# EAGLE design power_board (EAGLE 7.6.0)
DRAWING_NAME: Xiaochuan Chen; DRAWING_TITLE: ARVP Power Board; REVISION: 3.0
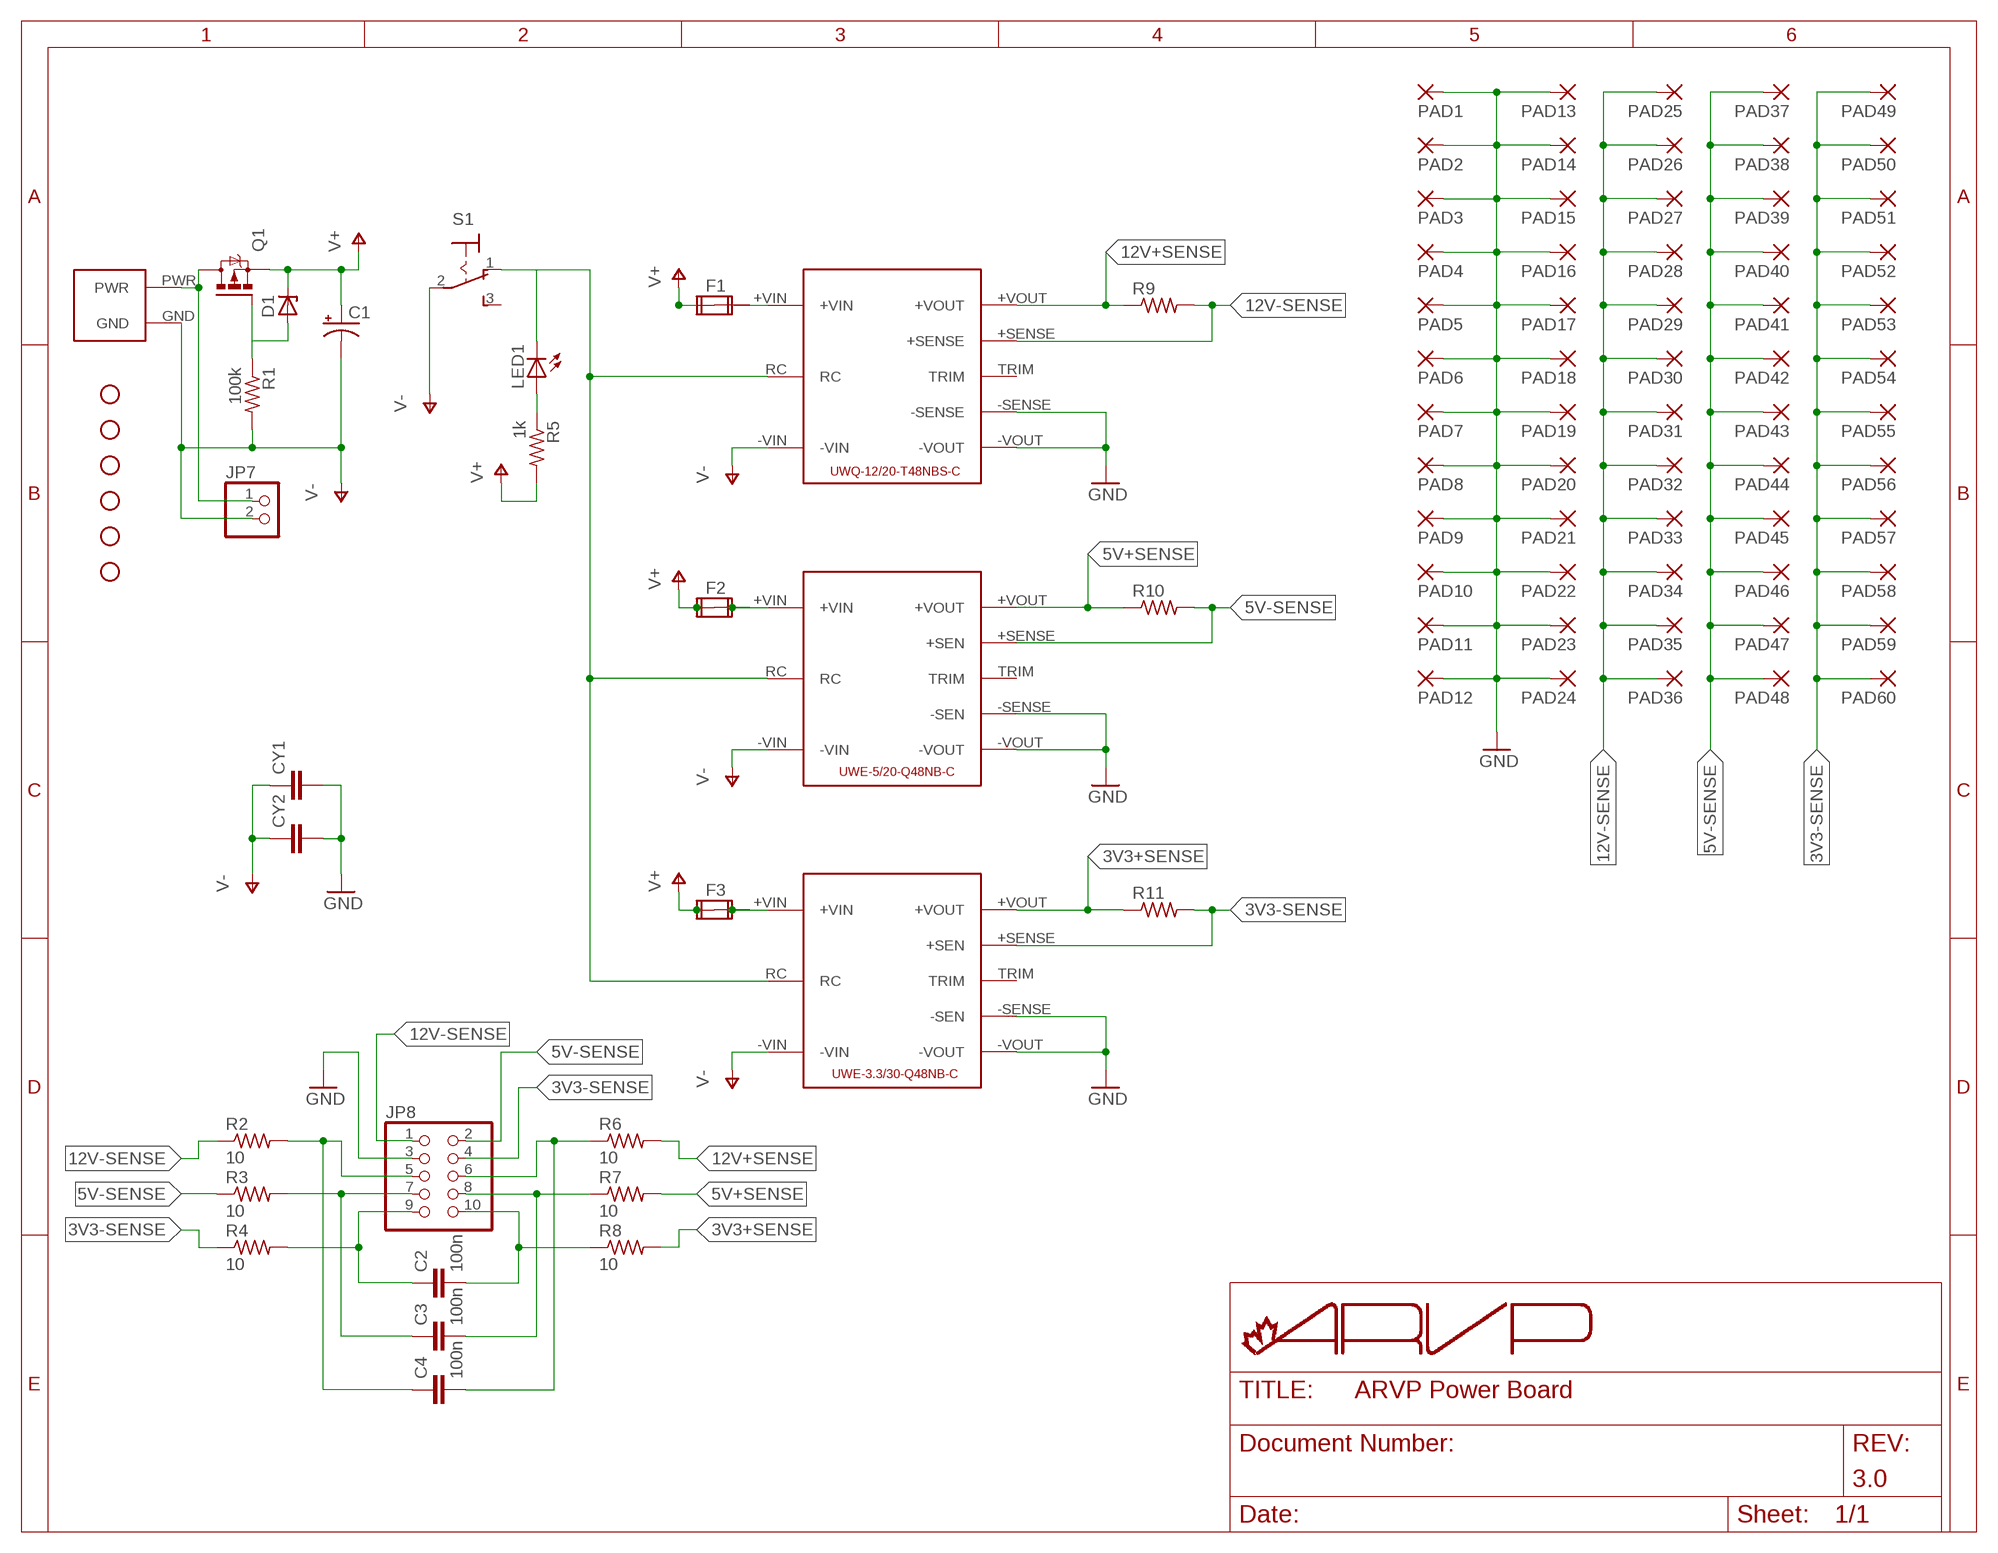
[diagram p0: schematic, sheet 1]

## Parts
C1  CPOL-USE5-10.5  [E5-10,5]
C2  100n  C-EU025-024X044  [C025-024X044]
C3  100n  C-EU025-024X044  [C025-024X044]
C4  100n  C-EU025-024X044  [C025-024X044]
CY1  CYYC7B5  [YC7B5]
CY2  CYYC7B5  [YC7B5]
D1  ZENER-DIODEDO35Z10  [DO35Z10]
F1  FUSE2P  [FUSE1]
F2  FUSE2P  [FUSE1]
F3  FUSE2P  [FUSE1]
JP1  STAND-OFF  [STAND-OFF]
JP2  STAND-OFF  [STAND-OFF]
JP3  STAND-OFF  [STAND-OFF]
JP4  STAND-OFF  [STAND-OFF]
JP5  STAND-OFF  [STAND-OFF]
JP6  STAND-OFF  [STAND-OFF]
JP7  PINHD-1X2  [1X02]
JP8  PINHD-2X5  [2X05]
LED1  LED3MM  [LED3MM]
P$1  AND_PWR  [AND_PWR]
PAD1  2,15/1,0  [2,15/1,0]
PAD2  2,15/1,0  [2,15/1,0]
PAD3  2,15/1,0  [2,15/1,0]
PAD4  2,15/1,0  [2,15/1,0]
PAD5  2,15/1,0  [2,15/1,0]
PAD6  2,15/1,0  [2,15/1,0]
PAD7  2,15/1,0  [2,15/1,0]
PAD8  2,15/1,0  [2,15/1,0]
PAD9  2,15/1,0  [2,15/1,0]
PAD10  2,15/1,0  [2,15/1,0]
PAD11  2,15/1,0  [2,15/1,0]
PAD12  2,15/1,0  [2,15/1,0]
PAD13  2,15/1,0  [2,15/1,0]
PAD14  2,15/1,0  [2,15/1,0]
PAD15  2,15/1,0  [2,15/1,0]
PAD16  2,15/1,0  [2,15/1,0]
PAD17  2,15/1,0  [2,15/1,0]
PAD18  2,15/1,0  [2,15/1,0]
PAD19  2,15/1,0  [2,15/1,0]
PAD20  2,15/1,0  [2,15/1,0]
PAD21  2,15/1,0  [2,15/1,0]
PAD22  2,15/1,0  [2,15/1,0]
PAD23  2,15/1,0  [2,15/1,0]
PAD24  2,15/1,0  [2,15/1,0]
PAD25  2,15/1,0  [2,15/1,0]
PAD26  2,15/1,0  [2,15/1,0]
PAD27  2,15/1,0  [2,15/1,0]
PAD28  2,15/1,0  [2,15/1,0]
PAD29  2,15/1,0  [2,15/1,0]
PAD30  2,15/1,0  [2,15/1,0]
PAD31  2,15/1,0  [2,15/1,0]
PAD32  2,15/1,0  [2,15/1,0]
PAD33  2,15/1,0  [2,15/1,0]
PAD34  2,15/1,0  [2,15/1,0]
PAD35  2,15/1,0  [2,15/1,0]
PAD36  2,15/1,0  [2,15/1,0]
PAD37  2,15/1,0  [2,15/1,0]
PAD38  2,15/1,0  [2,15/1,0]
PAD39  2,15/1,0  [2,15/1,0]
PAD40  2,15/1,0  [2,15/1,0]
PAD41  2,15/1,0  [2,15/1,0]
PAD42  2,15/1,0  [2,15/1,0]
PAD43  2,15/1,0  [2,15/1,0]
PAD44  2,15/1,0  [2,15/1,0]
PAD45  2,15/1,0  [2,15/1,0]
PAD46  2,15/1,0  [2,15/1,0]
PAD47  2,15/1,0  [2,15/1,0]
PAD48  2,15/1,0  [2,15/1,0]
PAD49  2,15/1,0  [2,15/1,0]
PAD50  2,15/1,0  [2,15/1,0]
PAD51  2,15/1,0  [2,15/1,0]
PAD52  2,15/1,0  [2,15/1,0]
PAD53  2,15/1,0  [2,15/1,0]
PAD54  2,15/1,0  [2,15/1,0]
PAD55  2,15/1,0  [2,15/1,0]
PAD56  2,15/1,0  [2,15/1,0]
PAD57  2,15/1,0  [2,15/1,0]
PAD58  2,15/1,0  [2,15/1,0]
PAD59  2,15/1,0  [2,15/1,0]
PAD60  2,15/1,0  [2,15/1,0]
Q1  IPP80P03P4L04AKSA1  [TO220BV]
R1  100k  R-US_0204/7  [0204/7]
R2  10  R-US_0204/5  [0204/5]
R3  10  R-US_0204/5  [0204/5]
R4  10  R-US_0204/5  [0204/5]
R5  1k  R-US_0204/7  [0204/7]
R6  10  R-US_0204/5  [0204/5]
R7  10  R-US_0204/5  [0204/5]
R8  10  R-US_0204/5  [0204/5]
R9  R-US_0617/22  [0617/22]
R10  R-US_0617/22  [0617/22]
R11  R-US_0617/22  [0617/22]
S1  M9040P  [M9040P]
U1  UWQ-12/20-T48NBS-C  [UWQ-12/20-T48]
U2  UWE-5/20-Q48NB-C  [UWE-100-120W]
U3  UWE-3.3/30-Q48NB-C  [UWE-100-120W]

## Nets
3V3+SENSE: R8.2 R11.1 U3.+VOUT
3V3-SENSE: JP8.4 PAD49.1(P) PAD50.1(P) PAD51.1(P) PAD52.1(P) PAD53.1(P) PAD54.1(P) PAD55.1(P) PAD56.1(P) PAD57.1(P) PAD58.1(P) PAD59.1(P) PAD60.1(P) R4.1 R11.2 U3.+SENSE(+SEN)
5V+SENSE: R7.2 R10.1 U2.+VOUT
5V-SENSE: JP8.2 PAD37.1(P) PAD38.1(P) PAD39.1(P) PAD40.1(P) PAD41.1(P) PAD42.1(P) PAD43.1(P) PAD44.1(P) PAD45.1(P) PAD46.1(P) PAD47.1(P) PAD48.1(P) R3.1 R10.2 U2.+SENSE(+SEN)
12V+SENSE: R6.2 R9.1 U1.+VOUT
12V-SENSE: JP8.1 PAD25.1(P) PAD26.1(P) PAD27.1(P) PAD28.1(P) PAD29.1(P) PAD30.1(P) PAD31.1(P) PAD32.1(P) PAD33.1(P) PAD34.1(P) PAD35.1(P) PAD36.1(P) R2.1 R9.2 U1.+SENSE
GND: CY1.2 CY2.2 JP8.3 PAD1.1(P) PAD2.1(P) PAD3.1(P) PAD4.1(P) PAD5.1(P) PAD6.1(P) PAD7.1(P) PAD8.1(P) PAD9.1(P) PAD10.1(P) PAD11.1(P) PAD12.1(P) PAD13.1(P) PAD14.1(P) PAD15.1(P) PAD16.1(P) PAD17.1(P) PAD18.1(P) PAD19.1(P) PAD20.1(P) PAD21.1(P) PAD22.1(P) PAD23.1(P) PAD24.1(P) U1.-SENSE U1.-VOUT U2.-SENSE(-SEN) U2.-VOUT U3.-SENSE(-SEN) U3.-VOUT
J3: C4.1 JP8.5 R2.2
J4: C4.2 JP8.6 R6.1
J5: C3.1 JP8.7 R3.2
J6: C3.2 JP8.8 R7.1
J7: C2.1 JP8.9 R4.2
J8: C2.2 JP8.10 R8.1
N$1: LED1.A R5.1
N$4: D1.A Q1.G R1.1
N$5: F1.2A F1.2B U1.+VIN
N$6: F2.2A F2.2B U2.+VIN
N$7: F3.2A F3.2B U3.+VIN
ON/OFF: LED1.K(C) S1.1(O) U1.RC U2.RC U3.RC
V+: C1.+ D1.C F1.1A F1.1B F2.1A F2.1B F3.1A F3.1B Q1.S R5.2
V-: C1.- CY1.1 CY2.1 JP7.2 P$1.GND R1.2 S1.2(P) U1.-VIN U2.-VIN U3.-VIN
VBAT+: JP7.1 P$1.PWR Q1.D
Unconnected: S1.3(S) U1.TRIM U2.TRIM U3.TRIM

## Library data of the parts
C1 = rcl:CPOL-US: POLARIZED CAPACITOR, American symbol
C2-C4 = rcl:C-EU: CAPACITOR, European symbol
CY1 CY2 = rcl:CY: Y CAPACITOR for power line
D1 = diode:ZENER-DIODE: Z-Diode
F1-F3 = special:FUSE2P: FUSE 5 x 20 mm
JP1-JP6 = SparkFun:STAND-OFF: Stand Off This is the mechanical footprint for a #4 phillips button head screw. Use the keepout ring to avoid running the screw head into surrounding components. SKU : PRT-00447
JP7 = pinhead:PINHD-1X2: PIN HEADER
JP8 = pinhead:PINHD-2X5: PIN HEADER
LED1 = led:LED: LED OSRAM: - CHIPLED LG R971, LG N971, LY N971, LG Q971, LY Q971, LO R971, LY R971 LH N974, LH R974 LS Q976, LO Q976, LY Q976 LO Q996 - Hyper CHIPLED LW Q18S LB Q993, LB Q99A, LB R99A - SideLED LS A670, LO A670, LY A670, LG A670, LP A670 LB A673, LV A673, LT A673, LW A673 LH A674 LY A675 LS A676, LA A676, LO A676, LY A676, LW A676 LS A679, LY A679, LG A679 - Hyper Micro SIDELED® LS Y876, LA Y876, LO Y876, LY Y876 LT Y87S - SmartLED LW L88C, LW L88S LB L89C, LB L89S, LG L890 LS L89K, LO L89K, LY L89K LS L896, LA L896, LO L896, LY L896 - TOPLED LS T670, LO T670, LY T670, LG T670, LP T670 LSG T670, LSP T670, LSY T670, LOP T670, LYG T670 LG T671, LOG T671, LSG T671 LB T673, LV T673, LT T673, LW T673 LH T674 LS T676, LA T676, LO T676, LY T676, LB T676, LH T676, LSB T676, LW T676 LB T67C, LV T67C, LT T67C, LS T67K, LO T67K, LY T67K, LW E67C LS E67B, LA E67B, LO E67B, LY E67B, LB E67C, LV E67C, LT E67C LW T67C LS T679, LY T679, LG T679 LS T770, LO T770, LY T770, LG T770, LP T770 LB T773, LV T773, LT T773, LW T773 LH T774 LS E675, LA E675, LY E675, LS T675 LS T776, LA T776, LO T776, LY T776, LB T776 LHGB T686 LT T68C, LB T68C - Hyper Mini TOPLED® LB M676 - Mini TOPLED Santana® LG M470 LS M47K, LO M47K, LY M47K Source: http://www.osram.convergy.de LUXEON: - LUMILED® LXK2-PW12-R00, LXK2-PW12-S00, LXK2-PW14-U00, LXK2-PW14-V00 LXK2-PM12-R00, LXK2-PM12-S00, LXK2-PM14-U00 LXK2-PE12-Q00, LXK2-PE12-R00, LXK2-PE12-S00, LXK2-PE14-T00, LXK2-PE14-U00 LXK2-PB12-K00, LXK2-PB12-L00, LXK2-PB12-M00, LXK2-PB14-N00, LXK2-PB14-P00, LXK2-PB14-Q00 LXK2-PR12-L00, LXK2-PR12-M00, LXK2-PR14-Q00, LXK2-PR14-R00 LXK2-PD12-Q00, LXK2-PD12-R00, LXK2-PD12-S00 LXK2-PH12-R00, LXK2-PH12-S00 LXK2-PL12-P00, LXK2-PL12-Q00, LXK2-PL12-R00 Source: www.luxeon.com KINGBRIGHT: KA-3528ASYC Source: www.kingbright.com
P$1 = ARVP:AND_PWR
PAD1-PAD60 = wirepad:2,15/1,0: THROUGH-HOLE PAD
Q1 = transistor-power:IPP80P03P4L04AKSA1: P-CHANNEL MOS-FET SYMBOL
R1 R5 = resistor:R-US_: RESISTOR, American symbol
R2-R4 R6-R11 = rcl:R-US_: RESISTOR, American symbol
S1 = switch:M9040P: TOGGLE SWITCH Marquardt
U1 = New Power Board Library:UWQ-12/20-T48NBS-C
U2 = New Power Board Library:UWE-5/20-Q48NB-C
U3 = New Power Board Library:UWE-3.3/30-Q48NB-C

## Net classes
0 default: clearance 0.205 mm

## Board
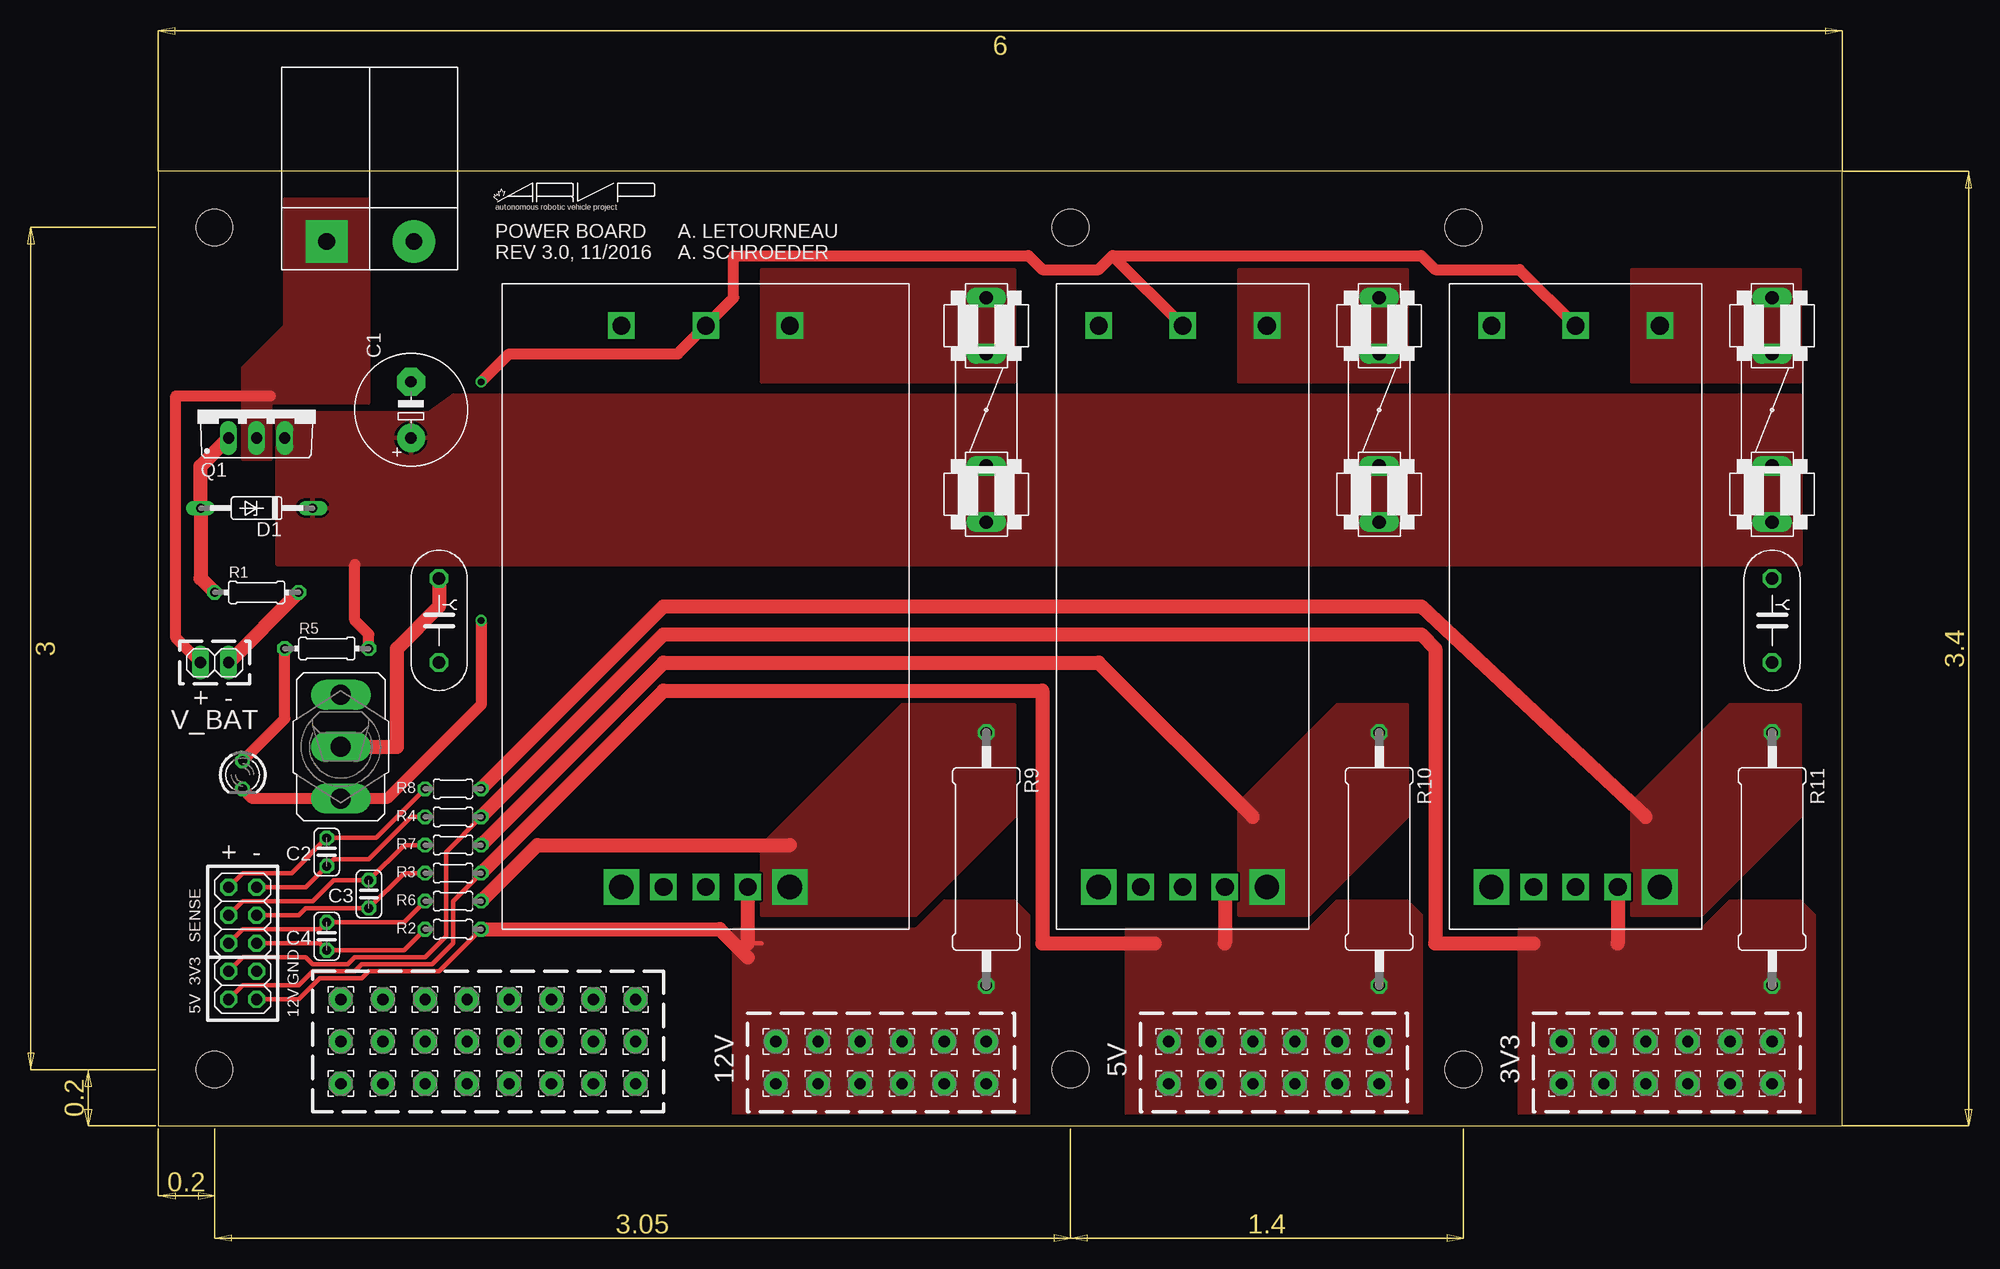
[diagram p1: board, top side]
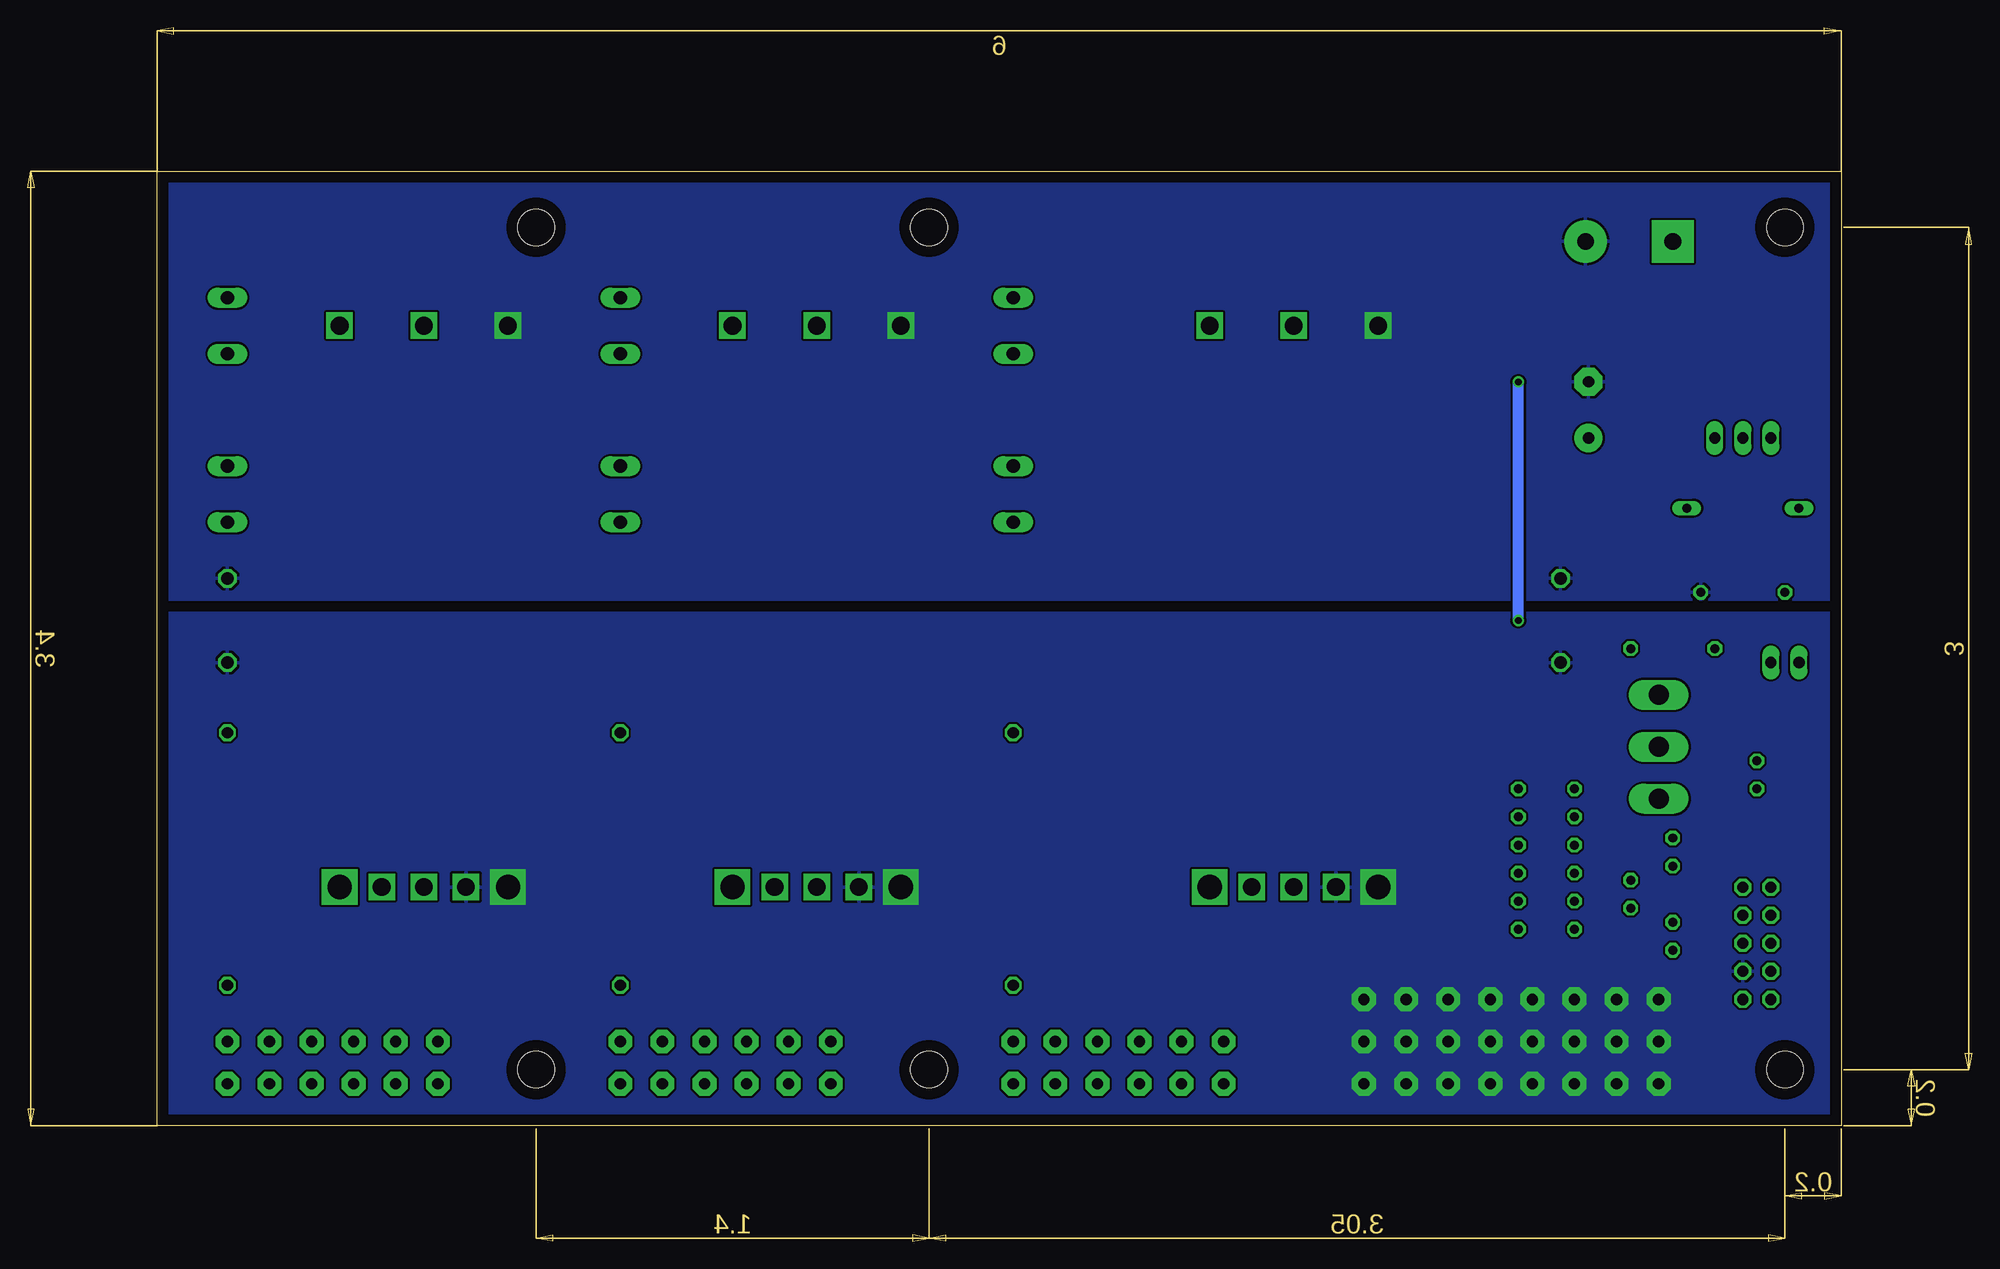
[diagram p2: board, bottom side, seen from below]

Size 152.4 x 86.36 mm. Coordinates in mm from the lower left corner, seen from the top.
Outline: 0,0 152.4,0 152.4,86.36 0,86.36 0,0
Copper layers (1*16): Top 0.035mm / dielectric 1.5mm / Bottom 0.035mm
Design rules "Power_Board": minimum track width 20mil, minimum drill 24mil, track to track 0.205mm, track to pad 12mil, pad to pad 0.205mm, via to via 0.205mm, smd to smd 8mil, copper to edge 40mil, drill to drill 8mil, minimum pad ring 10mil, minimum via ring 8mil, stop-mask expansion 4mil, vias tented up to drill 0mil, thermal gap 10mil

### Footprints (pad centres in the part's own frame; a part is rotated, then mirrored left to right if it is on the bottom)
E5-10,5 = drill 1.016 pad 2.54: + -2.54,0 | drill 1.016 pad 2.54 octagon: - 2.54,0
C025-024X044 = drill 0.813 octagon: 1 -1.27,0; 2 1.27,0
YC7B5 = drill 1.118 octagon: 1 -3.81,0; 2 3.81,0
DO35Z10 = drill 0.813 long: A 5.08,0; C -5.08,0
FUSE1 = drill 1.194 long: 1A -10.16,0; 1B -5.08,0; 2A 10.16,0; 2B 5.08,0
STAND-OFF = hole 3.302: 0,0
1X02 = drill 1.016 long: 1 -1.27,0; 2 1.27,0
2X05 = drill 1.016 octagon: 1 -5.08,-1.27; 2 -5.08,1.27; 3 -2.54,-1.27; 4 -2.54,1.27; 5 0,-1.27; 6 0,1.27; 7 2.54,-1.27; 8 2.54,1.27; 9 5.08,-1.27; 10 5.08,1.27
LED3MM = drill 0.813 octagon: A -1.27,0; K 1.27,0
AND_PWR = drill 1.524 pad 3.81: GND 0,-7.886 | drill 1.524 pad 3.81 square: PWR 0,0
2,15/1,0 = drill 1.016 pad 2.159 octagon: 1 0,0
TO220BV = drill 1.016 long: D 0,-2.54; G -2.54,-2.54; S 2.54,-2.54
0204/7 = drill 0.813 octagon: 1 -3.81,0; 2 3.81,0
0204/5 = drill 0.813 octagon: 1 -2.54,0; 2 2.54,0
0617/22 = drill 1.016 octagon: 1 -11.43,0; 2 11.43,0
M9040P = drill 1.803 long: 1 0,4.699; 2 0,0; 3 0,-4.699
UWQ-12/20-T48 = drill 1.6 square: +SENSE 25.4,3.81; +VIN -25.4,7.62; -SENSE 25.4,-3.81; -VIN -25.4,-7.62; RC -25.4,0; TRIM 25.4,0 | drill 2.2 square: +VOUT 25.4,7.62; -VOUT 25.4,-7.62
UWE-100-120W = drill 1.6 square: +SENSE 25.4,3.81; +VIN -25.4,7.62; -SENSE 25.4,-3.81; -VIN -25.4,-7.62; RC -25.4,0; TRIM 25.4,0 | drill 2.2 square: +VOUT 25.4,7.62; -VOUT 25.4,-7.62

### Placement (x,y rotation side)
C1  22.86,64.77 90 top
C2  15.24,24.77 90 top
C3  19.05,20.95 90 top
C4  15.24,17.14 90 top
CY1  25.4,45.72 270 top
CY2  146.05,45.72 270 top
D1  8.89,55.88 180 top
F1  74.93,64.77 90 top
F2  110.49,64.77 90 top
F3  146.05,64.77 90 top
JP1  82.55,5.08 0 top
JP2  118.11,5.08 0 top
JP3  118.11,81.28 0 top
JP4  5.08,5.08 0 top
JP5  5.08,81.28 0 top
JP6  82.55,81.28 0 top
JP7  5.08,41.91 0 top
JP8  7.62,16.51 90 top
LED1  7.62,31.75 270 top
P$1  15.24,80.01 90 top
PAD1  43.18,11.43 0 top
PAD2  39.37,11.43 0 top
PAD3  35.56,11.43 0 top
PAD4  31.75,11.43 0 top
PAD5  27.94,11.43 0 top
PAD6  24.13,11.43 0 top
PAD7  20.32,11.43 0 top
PAD8  16.51,11.43 0 top
PAD9  16.51,7.62 0 top
PAD10  20.32,7.62 0 top
PAD11  24.13,7.62 0 top
PAD12  27.94,7.62 0 top
PAD13  31.75,7.62 0 top
PAD14  35.56,7.62 0 top
PAD15  39.37,7.62 0 top
PAD16  43.18,7.62 0 top
PAD17  43.18,3.81 0 top
PAD18  39.37,3.81 0 top
PAD19  35.56,3.81 0 top
PAD20  31.75,3.81 0 top
PAD21  27.94,3.81 0 top
PAD22  24.13,3.81 0 top
PAD23  20.32,3.81 0 top
PAD24  16.51,3.81 0 top
PAD25  71.12,7.62 0 top
PAD26  67.31,7.62 0 top
PAD27  63.5,7.62 0 top
PAD28  59.69,7.62 0 top
PAD29  55.88,7.62 0 top
PAD30  74.93,3.81 0 top
PAD31  71.12,3.81 0 top
PAD32  67.31,3.81 0 top
PAD33  63.5,3.81 0 top
PAD34  59.69,3.81 0 top
PAD35  55.88,3.81 0 top
PAD36  74.93,7.62 0 top
PAD37  106.68,3.81 0 top
PAD38  102.87,3.81 0 top
PAD39  99.06,3.81 0 top
PAD40  95.25,3.81 0 top
PAD41  91.44,3.81 0 top
PAD42  110.49,7.62 0 top
PAD43  106.68,7.62 0 top
PAD44  102.87,7.62 0 top
PAD45  99.06,7.62 0 top
PAD46  95.25,7.62 0 top
PAD47  91.44,7.62 0 top
PAD48  110.49,3.81 0 top
PAD49  142.24,3.81 0 top
PAD50  138.43,3.81 0 top
PAD51  134.62,3.81 0 top
PAD52  130.81,3.81 0 top
PAD53  127,3.81 0 top
PAD54  146.05,3.81 0 top
PAD55  146.05,7.62 0 top
PAD56  142.24,7.62 0 top
PAD57  138.43,7.62 0 top
PAD58  134.62,7.62 0 top
PAD59  130.81,7.62 0 top
PAD60  127,7.62 0 top
Q1  8.89,64.77 0 top
R1  8.89,48.26 0 top
R2  26.67,17.78 180 top
R3  26.67,22.86 180 top
R4  26.67,27.94 180 top
R5  15.24,43.18 0 top
R6  26.67,20.32 0 top
R7  26.67,25.4 0 top
R8  26.67,30.48 0 top
R9  74.93,24.13 270 top
R10  110.49,24.13 270 top
R11  146.05,24.13 270 top
S1  16.51,34.29 180 top
U1  49.53,46.99 270 top
U2  92.71,46.99 270 top
U3  128.27,46.99 270 top
U$1  [DINA5_L]  -30.48,-74.93 0 top  (outside the outline)
U$2  [DOCFIELD]  128.27,-71.12 0 top  (outside the outline)
U$3  [ARVP]  30.48,82.87 0 top

### Tracks (layer width: path | path; a pad name or v marks a point on that pad's centre or on a via)
3V3+SENSE
  Top 1.27: R8.2 45.72,46.99 114.3,46.99 134.62,27.94
  pour Top (no thermals): 148.59,38.1 142.24,38.1 133.35,29.21 133.35,19.05 139.7,19.05 148.59,27.94
3V3-SENSE
  Top 0.406: R4.1 26.04,24.77 26.04,17.14 24.13,15.24 17.78,15.24 17.14,14.61 13.97,14.61 13.34,15.24 7.62,15.24 JP8.4
  Top 1.27: U3.+SENSE 132.08,16.51 | R4.1 45.72,44.45 114.3,44.45 115.57,43.18 115.57,16.51 124.46,16.51
  pour Top (no thermals): 148.59,20.32 149.86,19.05 149.86,0 123.19,0 123.19,17.78 139.7,17.78 142.24,20.32
5V+SENSE
  Top 1.27: R7.2 45.72,41.91 85.09,41.91 99.06,27.94
  pour Top (no thermals): 97.79,19.05 97.79,29.21 106.68,38.1 113.03,38.1 113.03,27.94 104.14,19.05
5V-SENSE
  Top 0.406: R3.1 26.67,20.32 26.67,16.51 24.77,14.61 18.41,14.61 17.78,13.97 13.97,13.97 12.7,12.7 7.62,12.7 JP8.2
  Top 1.27: U2.+SENSE 96.52,16.51 | R3.1 45.72,39.37 80.01,39.37 80.01,16.51 90.17,16.51
  pour Top (no thermals): 113.03,20.32 106.68,20.32 104.14,17.78 87.63,17.78 87.63,0 114.3,0 114.3,19.05
12V+SENSE
  Top 1.27: R6.2 34.29,25.4 57.15,25.4
  pour Top (no thermals): 54.61,19.05 68.58,19.05 77.47,27.94 77.47,38.1 67.31,38.1 54.61,25.4
12V-SENSE
  Top 0.406: 53.34,16.51 54.61,16.51 | R2.1 25.4,13.97 19.05,13.97 18.41,13.34 14.61,13.34 12.7,11.43 JP8.1
  Top 1.27: U1.+SENSE 53.34,16.51 | R2.1 50.8,17.78 53.34,15.24
  pour Top (no thermals): 77.47,20.32 71.12,20.32 68.58,17.78 52.07,17.78 52.07,0 78.74,0 78.74,19.05
GND
  pour Bottom: 152.4,46.35 152.4,0 -1.27,0 -1.27,46.35
  pour Bottom (no thermals): 39.37,24.13 39.37,19.05 44.13,19.05 44.13,24.13
  pour Bottom (no thermals): 82.55,24.13 82.55,19.05 87.31,19.05 87.31,24.13
  pour Bottom (no thermals): 118.11,24.13 118.11,19.05 122.87,19.05 122.87,24.13
  pour Bottom (no thermals): 15.24,12.7 15.24,2.54 44.45,2.54 44.45,12.7
J3
  Top 0.406: R2.2 22.23,15.88 C4.1 14.61,16.51 JP8.5
J4
  Top 0.406: JP8.6 7.62,17.78 14.61,17.78 C4.2 22.23,18.41 R6.1
J5
  Top 0.406: JP8.7 12.7,19.05 13.34,19.68 C3.1 22.23,22.86 R3.2
J6
  Top 0.406: JP8.8 7.62,20.32 13.97,20.32 15.88,22.23 C3.2 22.23,25.4 R7.1
J7
  Top 0.406: R4.2 22.86,27.94 19.05,24.13 15.88,24.13 C2.1 13.34,21.59 JP8.9
J8
  Top 0.406: JP8.10 7.62,22.86 12.06,22.86 C2.2 19.68,26.04 R8.1
N$1
  Top 1: LED1.A 11.43,36.83 R5.1
N$4
  Top 1.27: Q1.G 3.81,59.69 D1.A 3.81,49.53 R1.1
N$5
  pour Top (no thermals): 77.47,67.31 77.47,77.47 54.61,77.47 54.61,67.31
N$6
  pour Top (no thermals): 113.03,77.47 97.79,77.47 97.79,67.31 113.03,67.31
N$7
  pour Top (no thermals): 148.59,77.47 133.35,77.47 133.35,67.31 148.59,67.31
ON/OFF  (via drill 0.6)
  Top 1: v29.21,67.31 31.75,69.85 46.99,69.85 U1.RC 52.07,74.93 52.07,78.74 78.74,78.74 80.01,77.47 85.09,77.47 86.36,78.74 | v29.21,45.72 29.21,38.1 20.7,29.59 S1.1 8.51,29.59 LED1.K | 86.36,78.74 114.3,78.74 115.57,77.47 123.19,77.47 U3.RC | 86.36,78.74 U2.RC
  Bottom 1: v29.21,45.72 v29.21,67.31
V+
  Top 1: R5.2 19.05,44.45 17.78,45.72 17.78,50.8
  pour Top: 10.79,64.45 24.45,64.45 26.67,66.04 148.59,66.04 148.59,50.8 10.79,50.8
  pour Top (no thermals): 13.97,64.45 13.97,59.69 10.79,59.69 10.79,64.14 11.11,64.45
  pour Top (no thermals): 69.85,62.23 69.85,52.07 148.59,52.07 148.59,62.23
V-
  Top 1.27: S1.2 21.59,34.29 21.59,43.18 25.4,46.99 CY1.1 | JP7.2 R1.2
  pour Bottom: 0,86.36 152.4,86.36 152.72,47.62 0,47.62
  pour Bottom (no thermals): 118.11,74.93 118.11,69.85 123.19,69.85 123.19,74.93
  pour Bottom (no thermals): 82.55,74.93 82.55,69.85 86.36,69.85 87.63,69.85 87.63,74.93
  pour Bottom (no thermals): 39.37,74.93 39.37,69.85 44.45,69.85 44.45,74.93
VBAT+
  Top 1: JP7.1 1.59,44.13 1.59,66.04 10.16,66.04
  pour Top (no thermals): 11.43,83.82 11.43,72.39 7.62,68.58 7.62,60.33 10.16,60.33 10.16,65.41 19.05,65.41 19.05,83.82

### Text on the board
tNames: POWER BOARD | A. LETOURNEAU | REV 3.0, 11/2016 | A. SCHROEDER | + | - | V_BAT | + | - | SENSE | 3V3 | GND | 5V | 12V | 12V | 5V | 3V3